# Altium schematic sheet BMS_BatteryThermistors.SchDoc
size A
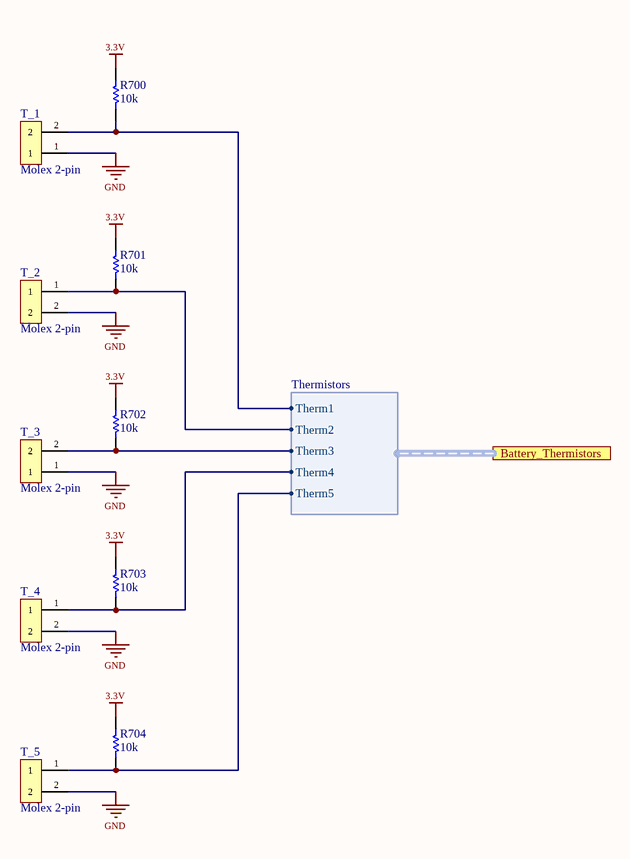
[diagram p0: BMS_BatteryThermistors.SchDoc]

## Parts
R700  value 10k  [RESC2012X07N]  (hidden comment: R0805)
R701  value 10k  [RESC2012X07N]  (hidden comment: R0805)
R702  value 10k  [RESC2012X07N]  (hidden comment: R0805)
R703  value 10k  [RESC2012X07N]  (hidden comment: R0805)
R704  value 10k  [RESC2012X07N]  (hidden comment: R0805)
T_1  Molex 2-pin  [ThermistorConnector]
T_2  Molex 2-pin  [ThermistorConnector]
T_3  Molex 2-pin  [ThermistorConnector]
T_4  Molex 2-pin  [ThermistorConnector]
T_5  Molex 2-pin  [ThermistorConnector]

## Ports
Battery_Thermistors (harness Thermistors)

## Harnesses
Thermistors: Therm5, Therm4, Therm3, Therm2, Therm1

## Nets
3.3V: R700.2 R701.2 R702.2 R703.2 R704.2
GND: T_1.1 T_2.2 T_3.1 T_4.2 T_5.2
NetR700_1: R700.1 T_1.2 ; port Battery_Thermistors.Therm1
NetR701_1: R701.1 T_2.1 ; port Battery_Thermistors.Therm2
NetR702_1: R702.1 T_3.2 ; port Battery_Thermistors.Therm3
NetR703_1: R703.1 T_4.1 ; port Battery_Thermistors.Therm4
NetR704_1: R704.1 T_5.1 ; port Battery_Thermistors.Therm5

## Library data of the parts
R700-R704 = Res1: Resistor; Published: 8-Jun-2000; LatestRevisionDate: 17-Jul-2002; LatestRevisionNote: Re-released for DXP Platform.; PackageReference: AXIAL-0.3; Publisher: Altium Limited; PackageDescription: Axial Device, Thru-Hole; 2 Leads; 0.3 in Pin Spacing
T_1-T_5 = Molex 2-pin: 2.54mm Pitch SL Wire-to-Board Header, Low Profile, Surface Mount, Single Row, Right-Angle, 3.05mm Pocket, Shrouded, with Press-fit Plastic Peg, 2 Circuits, Tin (Sn) Plating + SL Crimp Housing, Single Row, Version G, Positive Latch, 2 Circuits, Black